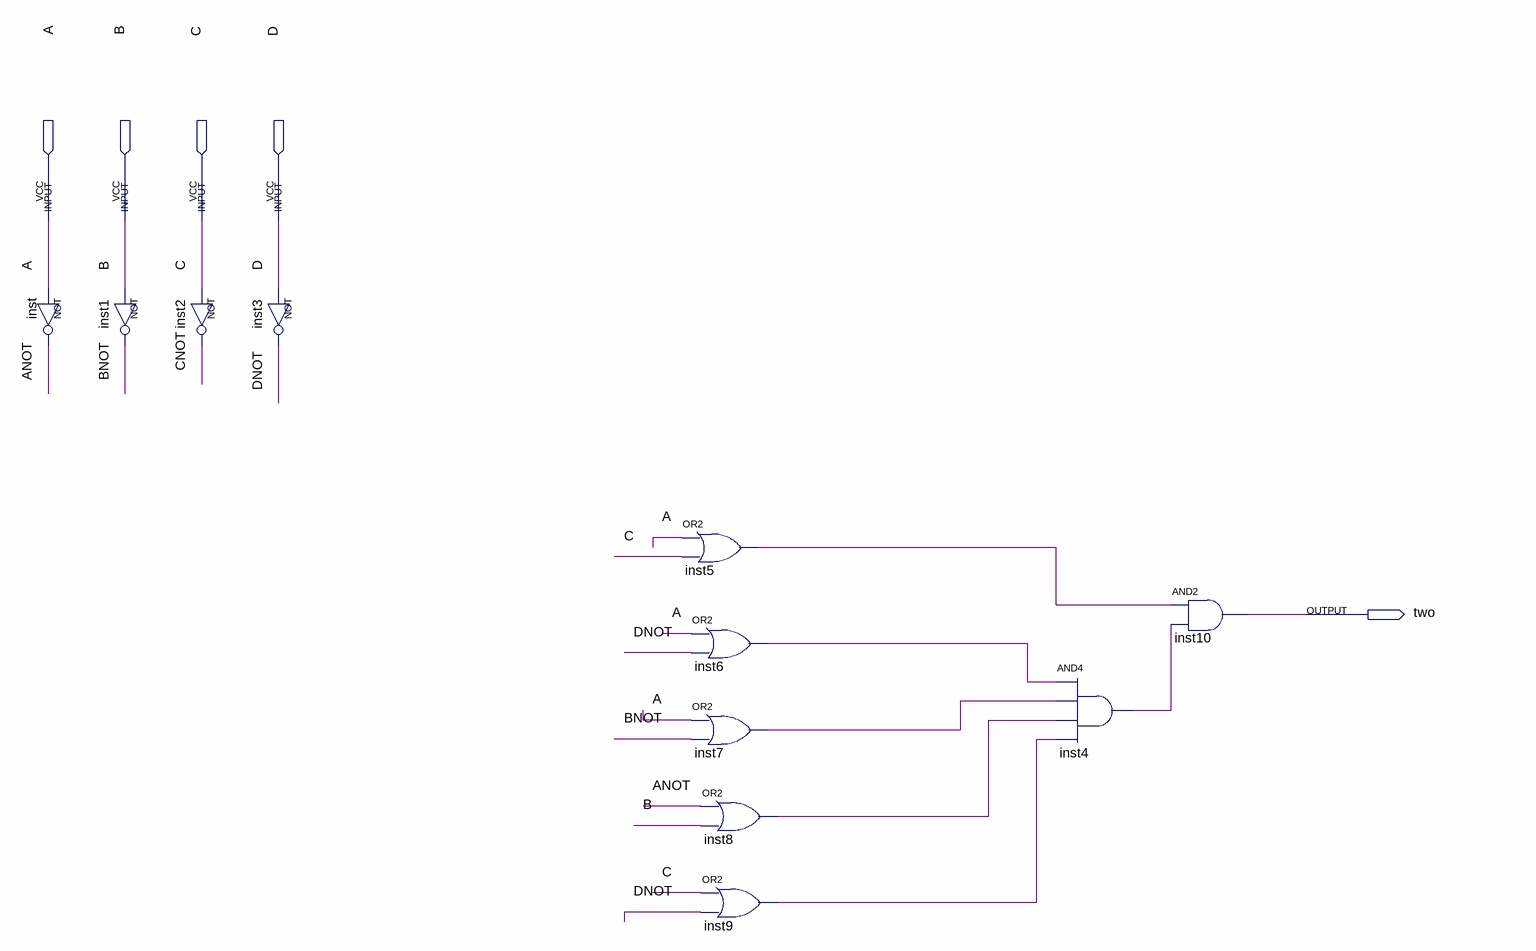
[diagram p0: schematic sheet]
// Quartus schematic output2.bdf as structural Verilog: 11 symbols, 5 pins
module output2 (
  input  A,
  input  B,
  input  C,
  input  D,
  output two
);

  wire ANOT, BNOT, CNOT, DNOT, inst4_out, inst5_out, inst6_out, inst7_out, inst8_out, inst9_out;

  not inst (ANOT, A);
  not inst1 (BNOT, B);
  not inst2 (CNOT, C);
  not inst3 (DNOT, D);
  or inst5 (inst5_out, A, C);
  or inst6 (inst6_out, A, DNOT);
  or inst7 (inst7_out, A, BNOT);
  or inst8 (inst8_out, ANOT, B);
  or inst9 (inst9_out, C, DNOT);
  and inst4 (inst4_out, inst6_out, inst7_out, inst8_out, inst9_out);
  and inst10 (two, inst5_out, inst4_out);
endmodule
